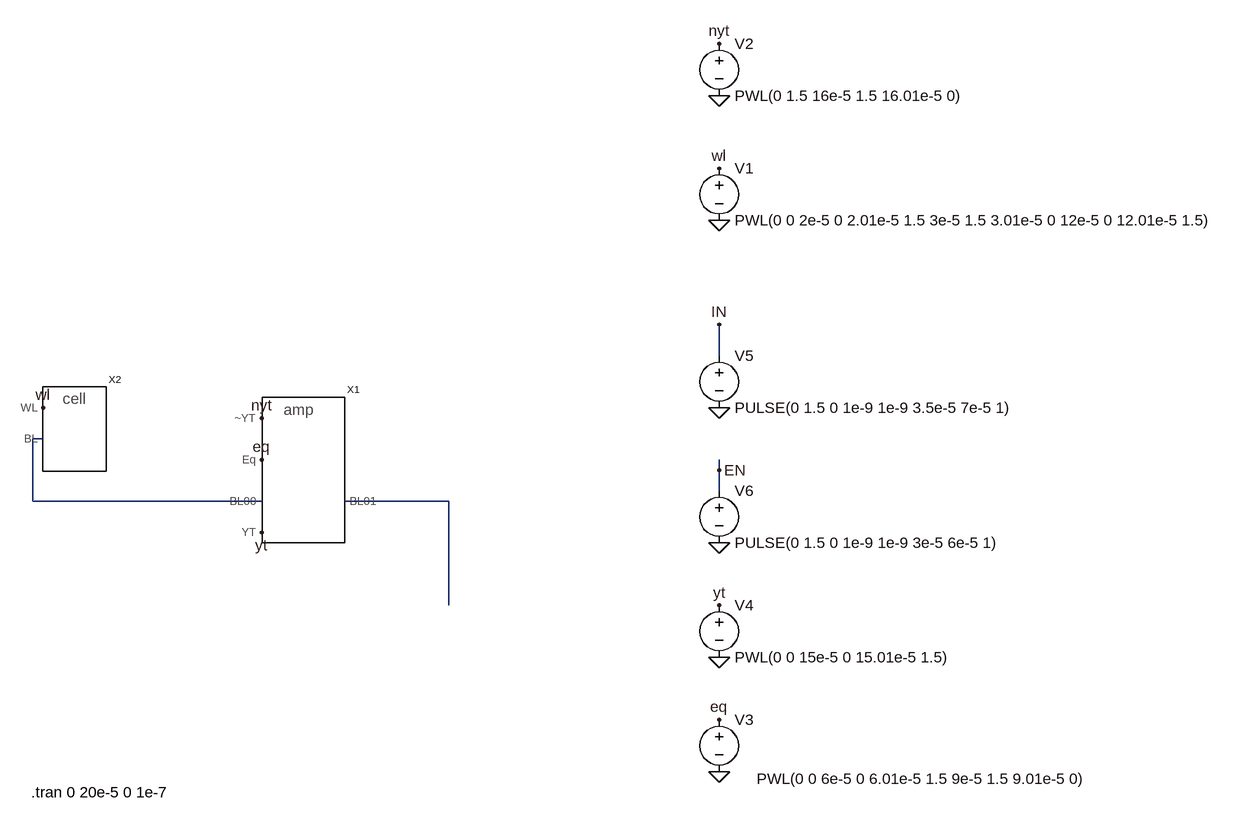
[diagram p0: schematic Draft3.asc]
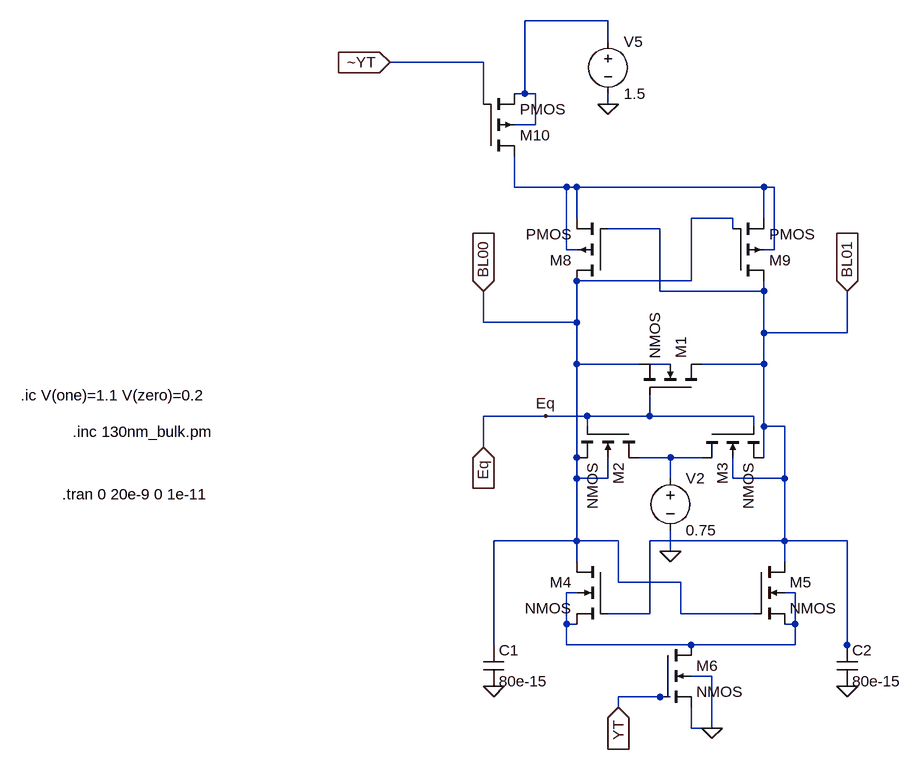
[diagram p1: sub-circuit amplifaer.asc]
Draft3.asc, the LTspice schematic file:
Version 4
SHEET 1 1620 1856
WIRE 32 1168 32 1120
WIRE -1008 1296 -1024 1296
WIRE 32 1344 32 1328
WIRE 32 1376 32 1344
WIRE -1024 1392 -1024 1296
WIRE -672 1392 -1024 1392
WIRE -384 1392 -544 1392
WIRE -384 1552 -384 1392
FLAG 32 1456 0
FLAG 32 1248 0
FLAG 32 1344 EN
FLAG 32 1120 IN
FLAG 32 768 0
FLAG 32 960 0
FLAG 32 1632 0
FLAG 32 1808 0
FLAG -672 1328 eq
FLAG 32 1728 eq
FLAG 32 1552 yt
FLAG -672 1440 yt
FLAG 32 688 nyt
FLAG -672 1264 nyt
FLAG -1008 1248 wl
FLAG 32 880 wl
SYMBOL amplifaer -560 1296 R0
SYMATTR InstName X1
SYMBOL voltage 32 864 R0
WINDOW 123 0 0 Left 0
WINDOW 39 0 0 Left 0
SYMATTR InstName V1
SYMATTR Value PWL(0 0 2e-5 0 2.01e-5 1.5 3e-5 1.5 3.01e-5 0 12e-5 0 12.01e-5 1.5)
SYMBOL voltage 32 672 R0
WINDOW 123 0 0 Left 0
WINDOW 39 0 0 Left 0
SYMATTR InstName V2
SYMATTR Value PWL(0 1.5 16e-5 1.5 16.01e-5 0)
SYMBOL voltage 32 1712 R0
WINDOW 3 58 107 Left 2
WINDOW 123 0 0 Left 0
WINDOW 39 0 0 Left 0
SYMATTR Value PWL(0 0 6e-5 0 6.01e-5 1.5 9e-5 1.5 9.01e-5 0)
SYMATTR InstName V3
SYMBOL voltage 32 1536 R0
WINDOW 123 0 0 Left 0
WINDOW 39 0 0 Left 0
SYMATTR InstName V4
SYMATTR Value PWL(0 0 15e-5 0 15.01e-5 1.5)
SYMBOL voltage 32 1152 R0
WINDOW 123 0 0 Left 0
WINDOW 39 0 0 Left 0
SYMATTR InstName V5
SYMATTR Value PULSE(0 1.5 0 1e-9 1e-9 3.5e-5 7e-5 1)
SYMBOL voltage 32 1360 R0
WINDOW 123 0 0 Left 0
WINDOW 39 0 0 Left 0
SYMATTR InstName V6
SYMATTR Value PULSE(0 1.5 0 1e-9 1e-9 3e-5 6e-5 1)
SYMBOL memory_cell -928 1280 R0
SYMATTR InstName X2
TEXT -1026 1840 Left 2 !.tran 0 20e-5 0 1e-7

amplifaer.asc, the sub-circuit schematic file:
Version 4
SHEET 1 880 680
WIRE 208 -544 80 -544
WIRE 208 -512 208 -544
WIRE 16 -480 -128 -480
WIRE 80 -432 80 -544
WIRE 80 -432 64 -432
WIRE 96 -432 80 -432
WIRE 16 -416 16 -480
WIRE 208 -416 208 -432
WIRE 96 -384 96 -432
WIRE 96 -384 64 -384
WIRE 64 -288 64 -336
WIRE 144 -288 64 -288
WIRE 160 -288 144 -288
WIRE 448 -288 160 -288
WIRE 464 -288 448 -288
WIRE 160 -240 160 -288
WIRE 400 -240 336 -240
WIRE 448 -240 448 -288
WIRE 288 -224 208 -224
WIRE 400 -224 400 -240
WIRE 144 -192 144 -288
WIRE 160 -192 144 -192
WIRE 464 -192 464 -288
WIRE 464 -192 448 -192
WIRE 336 -144 336 -240
WIRE 336 -144 160 -144
WIRE 288 -128 288 -224
WIRE 448 -128 448 -144
WIRE 448 -128 288 -128
WIRE 16 -80 16 -128
WIRE 160 -80 160 -144
WIRE 160 -80 16 -80
WIRE 448 -64 448 -128
WIRE 576 -64 576 -128
WIRE 576 -64 448 -64
WIRE 160 -16 160 -80
WIRE 256 -16 160 -16
WIRE 304 -16 272 -16
WIRE 448 -16 448 -64
WIRE 448 -16 352 -16
WIRE 112 64 16 64
WIRE 176 64 112 64
WIRE 272 64 272 32
WIRE 272 64 176 64
WIRE 432 64 272 64
WIRE 176 80 176 64
WIRE 432 80 432 64
WIRE 448 80 448 -16
WIRE 480 80 448 80
WIRE 16 112 16 64
WIRE 160 128 160 -16
WIRE 304 128 256 128
WIRE 352 128 304 128
WIRE 448 128 448 80
WIRE 160 160 160 128
WIRE 208 160 208 128
WIRE 208 160 160 160
WIRE 304 160 304 128
WIRE 400 160 400 128
WIRE 480 160 480 80
WIRE 480 160 400 160
WIRE 160 256 160 160
WIRE 160 256 32 256
WIRE 224 256 160 256
WIRE 480 256 480 160
WIRE 480 256 272 256
WIRE 576 256 480 256
WIRE 304 272 304 240
WIRE 160 288 160 256
WIRE 480 288 480 256
WIRE 224 320 224 256
WIRE 320 320 224 320
WIRE 160 336 144 336
WIRE 496 336 480 336
WIRE 272 368 272 256
WIRE 272 368 208 368
WIRE 320 368 320 320
WIRE 432 368 320 368
WIRE 144 384 144 336
WIRE 160 384 144 384
WIRE 496 384 496 336
WIRE 496 384 480 384
WIRE 32 416 32 256
WIRE 144 416 144 384
WIRE 336 416 144 416
WIRE 496 416 496 384
WIRE 496 416 336 416
WIRE 576 416 576 256
WIRE 576 432 576 416
WIRE 368 464 336 464
WIRE 288 496 224 496
WIRE 304 496 288 496
WIRE 224 512 224 496
WIRE 336 544 336 512
WIRE 368 544 368 464
WIRE 368 544 336 544
FLAG 304 272 0
FLAG 576 480 0
FLAG 32 480 0
FLAG 368 544 0
FLAG 112 64 Eq
FLAG 208 -416 0
FLAG 16 112 Eq
IOPIN 16 112 In
FLAG -128 -480 ~YT
IOPIN -128 -480 In
FLAG 16 -128 BL00
IOPIN 16 -128 In
FLAG 224 512 YT
IOPIN 224 512 In
FLAG 576 -128 BL01
IOPIN 576 -128 In
SYMBOL nmos4 352 32 M270
SYMATTR InstName M1
SYMATTR Value2 l=130e-9 w=1300e-9 ad=676000e-18 as=676000e-18 pd=3640e-9 ps=3640e-9
SYMBOL nmos4 256 80 R90
SYMATTR InstName M2
SYMATTR Value2 l=130e-9 w=1300e-9 ad=676000e-18 as=676000e-18 pd=3640e-9 ps=3640e-9
SYMBOL nmos4 352 80 M90
SYMATTR InstName M3
SYMATTR Value2 l=130e-9 w=1300e-9 ad=676000e-18 as=676000e-18 pd=3640e-9 ps=3640e-9
SYMBOL voltage 304 144 R0
WINDOW 123 0 0 Left 0
WINDOW 39 0 0 Left 0
SYMATTR InstName V2
SYMATTR Value 0.75
SYMBOL cap 16 416 R0
SYMATTR InstName C1
SYMATTR Value 80e-15
SYMBOL cap 560 416 R0
SYMATTR InstName C2
SYMATTR Value 80e-15
SYMBOL nmos4 208 288 M0
SYMATTR InstName M4
SYMATTR Value2 l=130e-9 w=1300e-9 ad=676000e-18 as=676000e-18 pd=3640e-9 ps=3640e-9
SYMBOL nmos4 432 288 R0
SYMATTR InstName M5
SYMATTR Value2 l=130e-9 w=1300e-9 ad=676000e-18 as=676000e-18 pd=3640e-9 ps=3640e-9
SYMBOL nmos4 288 416 R0
SYMATTR InstName M6
SYMATTR Value2 l=130e-9 w=1300e-9 ad=676000e-18 as=676000e-18 pd=3640e-9 ps=3640e-9
SYMBOL pmos4 208 -144 R180
SYMATTR InstName M8
SYMATTR Value2 l=130e-9 w=2600e-9 ad=676000e-18 as=676000e-18 pd=3640e-9 ps=3640e-9
SYMBOL pmos4 400 -144 M180
SYMATTR InstName M9
SYMATTR Value2 l=130e-9 w=12600e-9 ad=676000e-18 as=676000e-18 pd=3640e-9 ps=3640e-9
SYMBOL pmos4 16 -336 M180
SYMATTR InstName M10
SYMATTR Value2 l=130e-9 w=2600e-9 ad=676000e-18 as=676000e-18 pd=3640e-9 ps=3640e-9
SYMBOL voltage 208 -528 R0
WINDOW 123 0 0 Left 0
WINDOW 39 0 0 Left 0
SYMATTR InstName V5
SYMATTR Value 1.5
TEXT -616 88 Left 2 !.inc 130nm_bulk.pm
TEXT -632 184 Left 2 !.tran 0 20e-9 0 1e-11
TEXT -696 32 Left 2 !.ic V(one)=1.1 V(zero)=0.2

The netlist it stands for:
* Draft3.asc
XX1 eq yt nyt N001 N002 amplifaer
V1 wl 0 PWL(0 0 2e-5 0 2.01e-5 1.5 3e-5 1.5 3.01e-5 0 12e-5 0 12.01e-5 1.5)
V2 nyt 0 PWL(0 1.5 16e-5 1.5 16.01e-5 0)
V3 eq 0 PWL(0 0 6e-5 0 6.01e-5 1.5 9e-5 1.5 9.01e-5 0)
V4 yt 0 PWL(0 0 15e-5 0 15.01e-5 1.5)
V5 IN 0 PULSE(0 1.5 0 1e-9 1e-9 3.5e-5 7e-5 1)
V6 EN 0 PULSE(0 1.5 0 1e-9 1e-9 3e-5 6e-5 1)
XX2 wl N001 memory_cell  ; pins WL BL

* block symbol definitions
.subckt amplifaer Eq YT ~YT BL00 BL01
M1 BL01 Eq BL00 N003 NMOS l=130e-9 w=1300e-9 ad=676000e-18 as=676000e-18 pd=3640e-9 ps=3640e-9
M2 N004 Eq BL00 BL00 NMOS l=130e-9 w=1300e-9 ad=676000e-18 as=676000e-18 pd=3640e-9 ps=3640e-9
M3 N004 Eq BL01 BL01 NMOS l=130e-9 w=1300e-9 ad=676000e-18 as=676000e-18 pd=3640e-9 ps=3640e-9
V2 N004 0 0.75
C1 BL00 0 80e-15
C2 BL01 0 80e-15
M4 BL00 BL01 N005 N005 NMOS l=130e-9 w=1300e-9 ad=676000e-18 as=676000e-18 pd=3640e-9 ps=3640e-9
M5 BL01 BL00 N005 N005 NMOS l=130e-9 w=1300e-9 ad=676000e-18 as=676000e-18 pd=3640e-9 ps=3640e-9
M6 N005 YT 0 0 NMOS l=130e-9 w=1300e-9 ad=676000e-18 as=676000e-18 pd=3640e-9 ps=3640e-9
M8 BL00 BL01 N002 N002 PMOS l=130e-9 w=2600e-9 ad=676000e-18 as=676000e-18 pd=3640e-9 ps=3640e-9
M9 BL01 BL00 N002 N002 PMOS l=130e-9 w=12600e-9 ad=676000e-18 as=676000e-18 pd=3640e-9 ps=3640e-9
M10 N002 ~YT N001 N001 PMOS l=130e-9 w=2600e-9 ad=676000e-18 as=676000e-18 pd=3640e-9 ps=3640e-9
V5 N001 0 1.5
.inc 130nm_bulk.pm
.tran 0 20e-9 0 1e-11
.ic V(one)=1.1 V(zero)=0.2
.ends amplifaer

.model NMOS NMOS
.model PMOS PMOS
.lib standard.mos
.tran 0 20e-5 0 1e-7
.backanno
.end